# EAGLE design power (EAGLE 7.6.0)
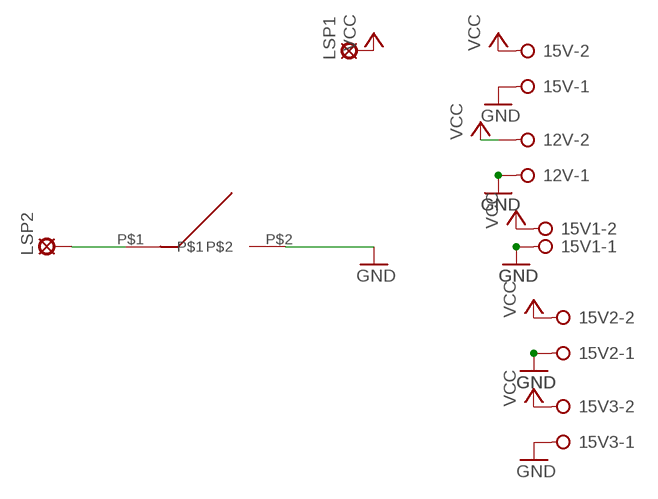
[diagram p0: schematic, sheet 1]

## Parts
12V  W237-02P  [W237-132]
15V  W237-02P  [W237-132]
15V1  W237-02P  [W237-132]
15V2  W237-02P  [W237-132]
15V3  W237-02P  [W237-132]
LSP1  SE14  [SE14]
LSP2  SE14  [SE14]
U$1  ON/OFF  [ON/OFF]

## Nets
GND: 12V.1 15V1.1 15V2.1 15V3.1 15V.1 U$1.P$2
N$1: LSP2.MP U$1.P$1
VCC: 12V.2 15V1.2 15V2.2 15V3.2 15V.2 LSP1.MP

## Library data of the parts
12V 15V 15V1-15V3 = con-wago-508:W237-02P: WAGO SREW CLAMP; OC_FARNELL: unknown; OC_NEWARK: unknown
LSP1 LSP2 = solpad:SE14: SOLDER PAD E1553, drill 1,4mm, distributor Buerklin, 07F820
U$1 = switch 1:ON/OFF

## Net classes
0 default: width 1.524 mm, clearance 0.381 mm

## Board
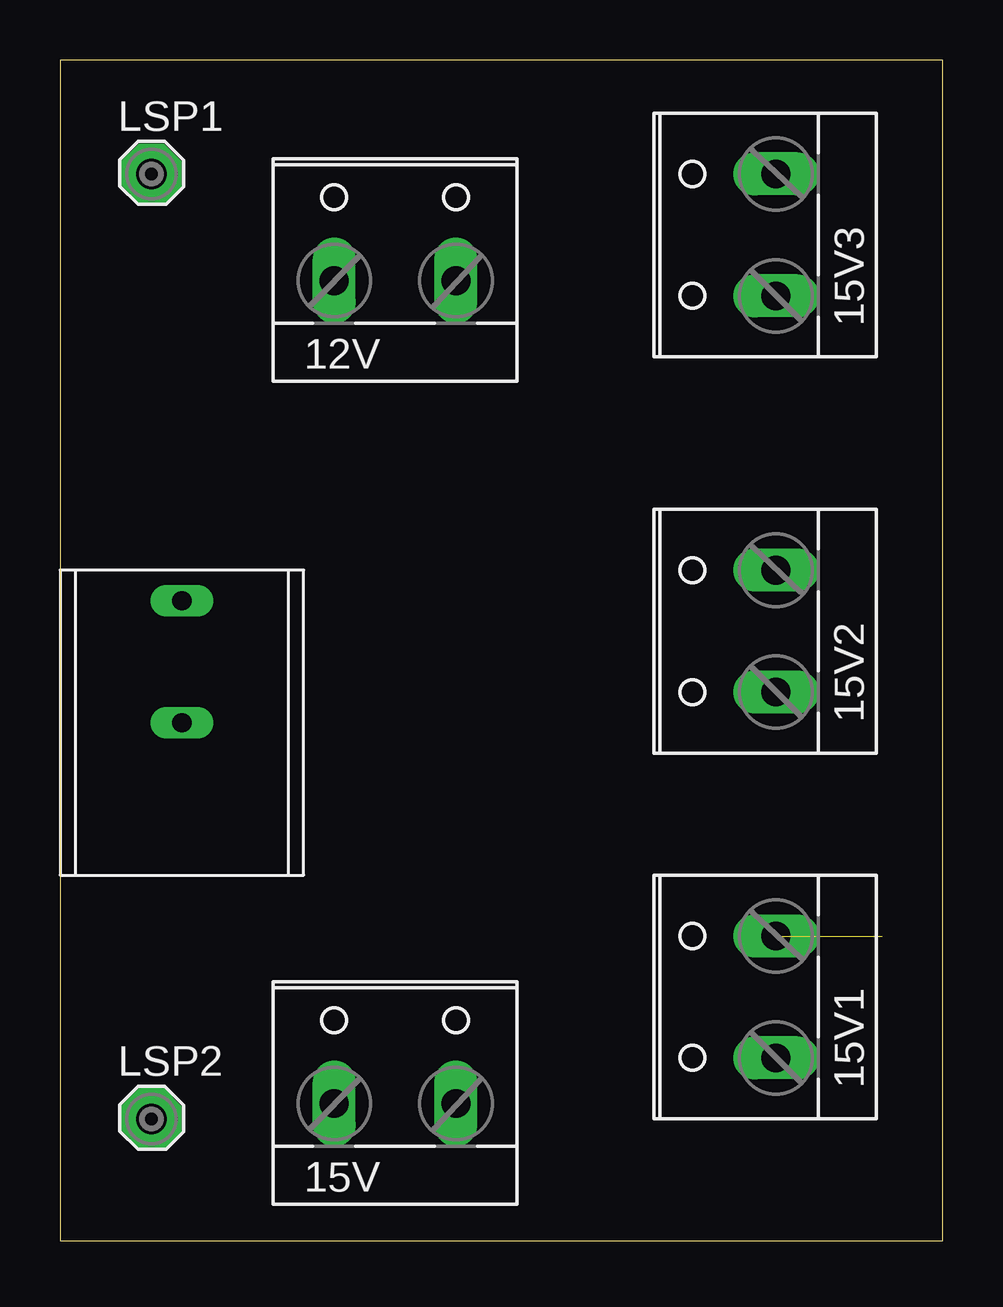
[diagram p1: board, top side]
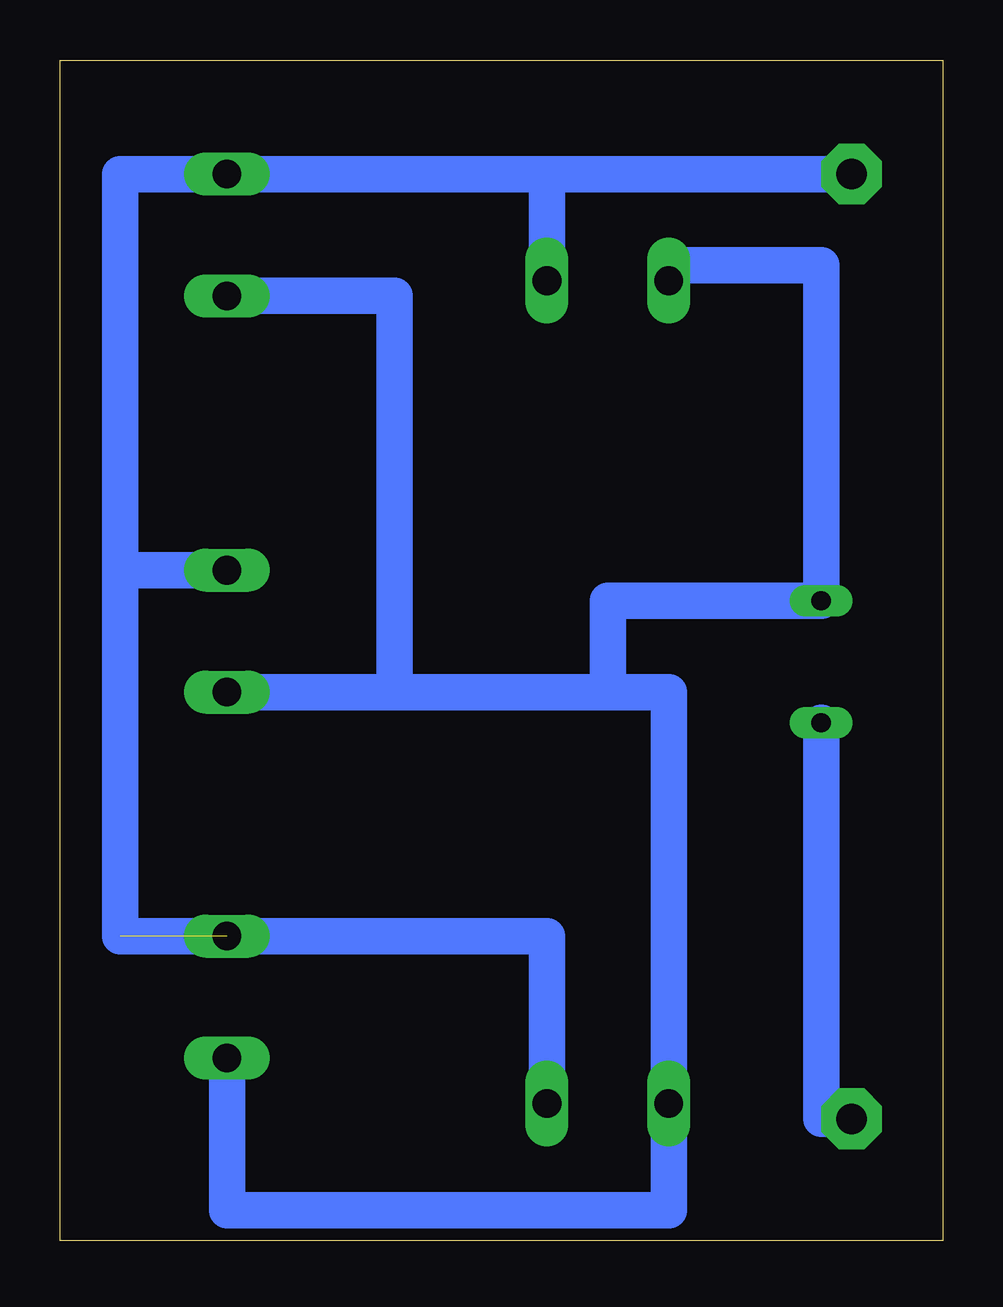
[diagram p2: board, bottom side, seen from below]

Size 36.81 x 49.2 mm. Coordinates in mm from the lower left corner, seen from the top.
Outline: 0,0 36.81,0 36.81,49.2 0,49.2 0,0
Copper layers (1*16): Top 0.035mm / dielectric 1.5mm / Bottom 0.035mm
Design rules "default": minimum track width 10mil, minimum drill 24mil, track to track 8mil, track to pad 8mil, pad to pad 8mil, via to via 8mil, smd to smd 8mil, copper to edge 40mil, drill to drill 8mil, minimum pad ring 10mil, minimum via ring 8mil, stop-mask expansion 4mil, vias tented up to drill 0mil, thermal gap 10mil

### Footprints (pad centres in the part's own frame; a part is rotated, then mirrored left to right if it is on the bottom)
W237-132 = drill 1.194 long: 1 -2.54,-0.635; 2 2.54,-0.635
SE14 = drill 1.27 pad 2.54 octagon: MP 0,0
ON/OFF = drill 0.8 long: P$1 -2.54,0; P$2 2.54,0

### Placement (x,y rotation side)
12V  13.97,40.64 0 top
15V  13.97,6.35 0 top
15V1  29.21,10.16 90 top
15V2  29.21,25.4 90 top
15V3  29.21,41.91 90 top
LSP1  3.81,44.45 0 top
LSP2  3.81,5.08 0 top
U$1  5.08,24.13 90 top

### Tracks (layer width: path | path; a pad name or v marks a point on that pad's centre or on a via)
GND
  Bottom 1.524: 12V.1 11.43,40.64 5.08,40.64 U$1.P$2 13.97,26.67 13.97,22.86 | 15V1.1 29.84,1.27 11.43,1.27 15V.1 11.43,22.86 13.97,22.86 | 15V2.1 22.86,22.86 | 22.86,22.86 13.97,22.86 | 15V3.1 22.86,39.37 22.86,22.86
N$1
  Bottom 1.524: LSP2.MP 5.08,5.08 U$1.P$1
VCC  (1 unrouted)
  Bottom 1.524: LSP1.MP 16.51,44.45 | 16.51,44.45 15V3.2 34.29,44.45 34.29,27.94 | 12V.2 16.51,44.45 | 34.29,27.94 34.29,12.7 16.51,12.7 15V.2 | 29.21,27.94 15V2.2 34.29,27.94